# Altium project HVBoard.PrjPcb (part 1 of 2)
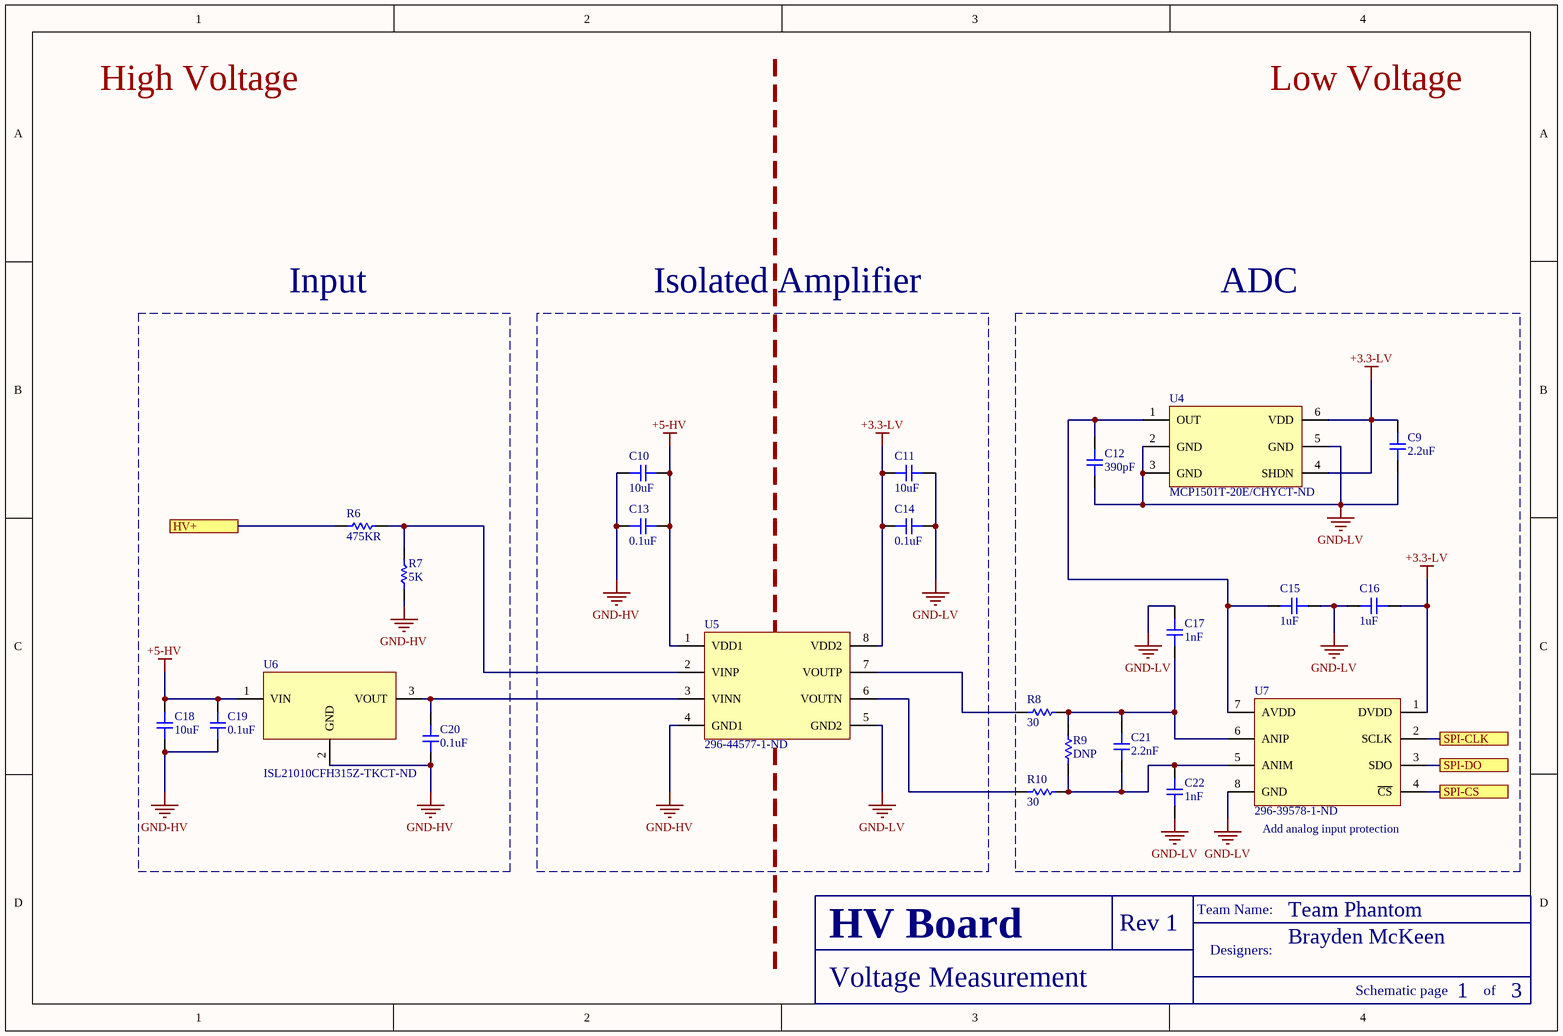
[diagram p0: VoltageMeasurement.SchDoc]
Board Name: HV Board; Designer1: Brayden McKeen; Rev: Rev 1; Team Name: Team Phantom
5 sheets, 89 parts. Net scope: global (net labels, ports and power ports of the same name join across sheets).
Board file: HVBoard_PCB.PcbDoc
Sheets:
  VoltageMeasurement.SchDoc
  IsoPowerSupply.SchDoc
  IMD.SchDoc
  ConnectorsAndProtection.SchDoc
  HVPowerSupply.SchDoc

## Sheet VoltageMeasurement.SchDoc
size A4; SheetNumber: 1; SheetTotal: 3; Schematic: Voltage Measurement

### Parts
C9  2.2uF  [CAP-0603]
C10  10uF  [CAP-1206]
C11  10uF  [CAP-1206]
C12  390pF  [CAP-0805]
C13  0.1uF  [CAP-0805]
C14  0.1uF  [CAP-0805]
C15  1uF  [CAP-0805]
C16  1uF  [CAP-0805]
C17  1nF  [CAP-0603]
C18  10uF  [CAP-1206]
C19  0.1uF  [CAP-0805]
C20  0.1uF  [CAP-0805]
C21  2.2nF  [CAP-0603]
C22  1nF  [CAP-0603]
R6  475KR  [RES-0805]
R7  5K  [RES-0603]
R8  30  [RES-0805]
R9  DNP  [RES-0805]
R10  30  [RES-0805]
U4  MCP1501T-20E/CHYCT-ND  [SOT-23-6]
U5  296-44577-1-ND  [8-SOICW]
U6  ISL21010CFH315Z-TKCT-ND  [SOT-23-3]
U7  296-39578-1-ND  [8VSSOP]

### Blocks framed on the sheet
Input: C18-C20 R6 R7 U6
Isolated Amplifier: C10 C11 C13 C14 U5
ADC: C9 C12 C15-C17 C21 C22 R8-R10 U4 U7

### Ports
HV+, SPI-CLK, SPI-CS, SPI-DO

### Nets
+3.3-LV: C9.2 C11.1 C14.1 C16.2 U4.4(SHDN) U4.6(VDD) U5.8(VDD2) U7.1(DVDD)
+5-HV: C10.2 C13.2 C18.2 C19.2 U5.1(VDD1) U6.1(VIN)
GND-HV: C10.1 C13.1 C18.1 C19.1 C20.1 R7.1 U5.4(GND1) U6.2(GND)
GND-LV: C9.1 C11.2 C12.1 C14.2 C15.2 C16.1 C17.2 C22.1 U4.2(GND) U4.3(GND) U4.5(GND) U5.5(GND2) U7.8(GND)
NetC1_2: R6.1 ; port HV+
NetC12_2: C12.2 C15.1 U4.1(OUT) U7.7(AVDD)
NetC17_1: C17.1 C21.2 R8.2 R9.2 U7.6(ANIP)
NetC20_2: C20.2 U5.3(VINN) U6.3(VOUT)
NetC21_1: C21.1 C22.2 R9.1 R10.2 U7.5(ANIM)
NetD6_11: U7.4(~{CS}) ; port SPI-CS
NetD6_12: U7.3(SDO) ; port SPI-DO
NetD6_13: U7.2(SCLK) ; port SPI-CLK
NetR6_2: R6.2 R7.2 U5.2(VINP)
NetR8_1: R8.1 U5.7(VOUTP)
NetR10_1: R10.1 U5.6(VOUTN)

### Notes on the sheet
- (near U7) Add analog input protection
- High Voltage
- Low Voltage
- Team Name:
- Designers:
- Schematic page
- of

### Library data of the parts
C9 = 0603-2.2uF-25V: CAP CER 2.2UF 25V X5R 0603; Manufacturer: Murata; Manufacturer Part Number: GRM188R61E225MA12D; Tolerance: 20%; Supplier 1: Digi-Key; Stock 1: 132633; Pricing 1: 1=0.16, 10=0.115, 100=0.0539, 500=0.03782, 1000=0.0313 (USD); Mount: Surface Mount; Case/Package: 0603; Weight: 0.000222oz; Case Code (Metric): 1608; Case Code (Imperial): 0603; Min Operating Temperature: -55°C; Max Operating Temperature: 85°C; Capacitance: 2.2uF; Packaging: Tape and Reel; Voltage Rating: 25V; Dielectric: X5R; Termination: SMD/SMT; Composition: Ceramic; Voltage Rating (DC): 25V; Package Quantity: 4000; Length: 0.063inch; Height: 0.8mm; Width: 0.031inch; Thickness: 0.035inch; ComponentLink1URL: http://search.murata.co.jp/Ceramy/image/img/A01X/G101/ENG/GRM188R61E225MA12-01.pdf?src-supplier=Digi-Key; ComponentLink1Description: http://search.murata.co.jp/Ceramy/image/img/A01X/G101/ENG/GRM188R61E225MA12-01.pdf?src-supplier=Digi-Key; ComponentLink2URL: http://www.mouser.com/ds/2/281/c02e-2905.pdf?src-supplier=Mouser; ComponentLink2Description: http://www.mouser.com/ds/2/281/c02e-2905.pdf?src-supplier=Mouser; Supplier Part Number 1: 490-12738-6-ND
C10 C11 C18 = 1206-10uF-50V: CAP CER 10UF 50V X5R 1206; Manufacturer: Murata; Manufacturer Part Number: GRT31CR61H106ME01L; Tolerance: 20%; Supplier 1: Digi-Key; Stock 1: 247205; Pricing 1: 1=0.5, 10=0.349, 100=0.2092, 500=0.1569, 1000=0.13249 (USD); Mount: Surface Mount; Case/Package: 1206; Case Code (Metric): 3216; Case Code (Imperial): 1206; Min Operating Temperature: -55°C; Max Operating Temperature: 85°C; Packaging: Tape and Reel; Capacitance: 10uF; Voltage Rating: 50V; Length: 0.126inch; Width: 0.063inch; Thickness: 0.071inch; Ratings: AEC-Q200; ComponentLink1URL: http://search.murata.co.jp/Ceramy/image/img/A01X/G101/ENG/GRT31CR61H106ME01-01.pdf?src-supplier=Digi-Key; ComponentLink1Description: http://search.murata.co.jp/Ceramy/image/img/A01X/G101/ENG/GRT31CR61H106ME01-01.pdf?src-supplier=Digi-Key; Supplier Part Number 1: 490-12457-1-ND
C12 = 0805-390pF-50V: CAP CER 390PF 50V C0G/NP0 0805; Manufacturer: KEMET; Manufacturer Part Number: C0805C391J5GACTU; Dielectric Material: Ceramic; Tolerance: 5%; Dissipation Factor: 0.1%; Dielectric: C0G; Supplier 1: Digi-Key; Stock 1: 12778; Pricing 1: 1=0.15, 10=0.105, 100=0.0495, 500=0.03472, 1000=0.02875 (USD); Mount: Surface Mount,PCB; Case/Package: 0805; Case Code (Metric): 2012; Case Code (Imperial): 0805; Contact Material: Tin; Contact Plating: Tin,Matte; Min Operating Temperature: -55°C; Max Operating Temperature: 125°C; Package Quantity: 1; Capacitance: 390pF; Voltage Rating: 50V; Packaging: Tape and Reel; Termination: SMD/SMT; Voltage Rating (DC): 50V; Voltage: 50V; Length: 2mm; Height: 0.78mm; Width: 0.049inch; Lead Pitch: 0.75mm; Depth: 1.25mm; Thickness: 0.035inch; Radiation Hardening: No; REACH SVHC: No SVHC; Lead Free: Lead Free; ComponentLink1URL: https://search.kemet.com/component-edge/download/datasheet/C0805C391J5GACTU.pdf?src-supplier=Digi-Key; ComponentLink1Description: https://search.kemet.com/component-edge/download/datasheet/C0805C391J5GACTU.pdf?src-supplier=Digi-Key; ComponentLink2URL: https://www.verical.com/server-webapp/html/getDatasheet?partID=35246&src-supplier=Verical; ComponentLink2Description: https://www.verical.com/server-webapp/html/getDatasheet?partID=35246&src-supplier=Verical; ComponentLink3URL: https://www.alliedelec.com/m/d/9bfe7773041ffe9d406e68bc7b377fdd.pdf?src-supplier=Allied+Electronics; ComponentLink3Description: https://www.alliedelec.com/m/d/9bfe7773041ffe9d406e68bc7b377fdd.pdf?src-supplier=Allied+Electronics; ComponentLink4URL: http://www.farnell.com/datasheets/1372242.pdf?src-supplier=Element14; ComponentLink4Description: http://www.farnell.com/datasheets/1372242.pdf?src-supplier=Element14; ComponentLink5URL: http://www.jameco.com/Jameco/Products/ProdDS/1567367.pdf?src-supplier=Jameco; ComponentLink5Description: http://www.jameco.com/Jameco/Products/ProdDS/1567367.pdf?src-supplier=Jameco; Supplier Part Number 1: 399-1132-6-ND
C13 C14 C19 C20 = 0805-0.1uF-16V: CAP CER 0.1UF 16V Y5V 0805; Manufacturer: KEMET; Manufacturer Part Number: C0805C104Z4VACTU; Dielectric Material: Ceramic; Capacitance: 100nF; Tolerance: 80%; Supplier 1: Digi-Key; Stock 1: 18565; Pricing 1: 1=0.11, 10=0.081, 100=0.038, 500=0.02664, 1000=0.02205 (USD); Mount: Surface Mount; Case/Package: 0805; Case Code (Metric): 2012; Case Code (Imperial): 0805; Min Operating Temperature: -30°C; Max Operating Temperature: 85°C; Package Quantity: 1; Voltage Rating: 16V; Packaging: Tape and Reel; Voltage Rating (DC): 16V; Dielectric: Y5V; Termination: SMD/SMT; Length: 2mm; Height: 0.78mm; Width: 0.049inch; Thickness: 0.035inch; Lead Pitch: 0.75mm; Depth: 1.25mm; Lead Free: Lead Free; ComponentLink1URL: https://search.kemet.com/component-edge/download/datasheet/C0805C104Z4VACTU.pdf?src-supplier=Digi-Key; ComponentLink1Description: https://search.kemet.com/component-edge/download/datasheet/C0805C104Z4VACTU.pdf?src-supplier=Digi-Key; ComponentLink2URL: https://api.kemet.com/component-edge/download/datasheet/C0805C104Z4VACTU.pdf?src-supplier=Digi-Key; ComponentLink2Description: https://api.kemet.com/component-edge/download/datasheet/C0805C104Z4VACTU.pdf?src-supplier=Digi-Key; ComponentLink3URL: http://www.mouser.com/ds/2/212/KEM_C1005_Y5V_SMD-1101305.pdf?src-supplier=Mouser; ComponentLink3Description: http://www.mouser.com/ds/2/212/KEM_C1005_Y5V_SMD-1101305.pdf?src-supplier=Mouser; ComponentLink4URL: http://components.arrow.com/part/dataview/2091119S8993596N7429?src-supplier=Arrow; ComponentLink4Description: http://components.arrow.com/part/dataview/2091119S8993596N7429?src-supplier=Arrow; Supplier Part Number 1: 399-9159-6-ND
C15 C16 = 0805-1uF-16V: CAP CER 1UF 16V Y5V 0805; Manufacturer: KEMET; Manufacturer Part Number: C0805C105Z4VACTU; Dielectric Material: Ceramic; Tolerance: 80%; Dissipation Factor: 7%; Supplier 1: Digi-Key; Stock 1: 54729; Pricing 1: 1=0.12, 10=0.085, 100=0.0378, 500=0.02702, 1000=0.02124 (USD); Mount: Surface Mount,PCB; Case/Package: 0805; Number of Pins: 2; Case Code (Metric): 2012; Case Code (Imperial): 0805; Contact Material: Tin; Min Operating Temperature: -30°C; Max Operating Temperature: 85°C; Package Quantity: 1; Capacitance: 1uF; Voltage Rating: 16V; Packaging: Tape and Reel; Voltage Rating (DC): 16V; Dielectric: Y5V; Termination: SMD/SMT; Voltage: 16V; Length: 2mm; Height: 1.25mm; Width: 0.049inch; Thickness: 0.055inch; Lead Pitch: 0.75mm; Depth: 1.25mm; Radiation Hardening: No; REACH SVHC: No SVHC; Lead Free: Lead Free; ComponentLink1URL: http://www.farnell.com/datasheets/2739656.pdf?src-supplier=Farnell; ComponentLink1Description: http://www.farnell.com/datasheets/2739656.pdf?src-supplier=Farnell; ComponentLink2URL: http://capacitoredge.kemet.com/capedge2/DataSheet?pn=C0805C105Z4VAC7800&src-supplier=Avnet+Europe; ComponentLink2Description: http://capacitoredge.kemet.com/capedge2/DataSheet?pn=C0805C105Z4VAC7800&src-supplier=Avnet+Europe; ComponentLink3URL: https://www.alliedelec.com/m/d/9bfe7773041ffe9d406e68bc7b377fdd.pdf?src-supplier=Allied+Electronics; ComponentLink3Description: https://www.alliedelec.com/m/d/9bfe7773041ffe9d406e68bc7b377fdd.pdf?src-supplier=Allied+Electronics; ComponentLink4URL: http://www.farnell.com/datasheets/2739656.pdf?src-supplier=Newark; ComponentLink4Description: http://www.farnell.com/datasheets/2739656.pdf?src-supplier=Newark; Supplier Part Number 1: 399-8011-6-ND
C17 C22 = 0603-1nF-50V: CAP CER 1000PF 50V X7R 0603; Manufacturer: KEMET; Manufacturer Part Number: C0603C102J5RACTU; Dielectric Material: Ceramic; Tolerance: 5%; Dissipation Factor: 2.5%; Supplier 1: Digi-Key; Stock 1: 378254; Pricing 1: 1=0.1, 10=0.056, 100=0.0248, 500=0.01772, 1000=0.01392 (USD); Mount: Surface Mount; Case/Package: 0603; Number of Pins: 2; Case Code (Imperial): 0603; Case Code (Metric): 1608; Min Operating Temperature: -55°C; Max Operating Temperature: 125°C; Packaging: Tape and Reel; Capacitance: 1nF; Dielectric: X7R; Voltage Rating (DC): 50V; Package Quantity: 1; Voltage Rating: 50V; Termination: SMD/SMT; Length: 1.6mm; Height: 0.8mm; Width: 0.031inch; Depth: 0.8mm; Thickness: 0.034inch; Lead Pitch: 0.7mm; Radiation Hardening: No; REACH SVHC: No SVHC; ComponentLink1URL: http://www.onlinecomponents.com/productFiles/mf-KEM/docfinderpartnumberc0402c102k5ractu.pdf?src-supplier=Onlinecomponents.com; ComponentLink1Description: http://www.onlinecomponents.com/productFiles/mf-KEM/docfinderpartnumberc0402c102k5ractu.pdf?src-supplier=Onlinecomponents.com; Supplier Part Number 1: 399-1083-6-ND
C21 = 0603-2.2nF-50V: CAP CER SMD 0603 2200PF 10% X7R; Manufacturer: KEMET; Manufacturer Part Number: C0603C222K5RAC7411; Dielectric Material: Ceramic; Voltage Rating: 50V; Dissipation Factor: 2.5%; Supplier 1: Digi-Key; Stock 1: 56383; Pricing 1: 1=0.1, 10=0.042, 100=0.0186, 500=0.01328, 1000=0.01044, 2500=0.00949, 5000=0.00873 (USD); Mount: Surface Mount; Case/Package: 0603; Case Code (Imperial): 0603; Case Code (Metric): 1608; Min Operating Temperature: -55°C; Max Operating Temperature: 125°C; Capacitance: 2.2nF; Tolerance: 10%; Package Quantity: 10000; Packaging: Tape and Reel; Voltage Rating (DC): 50V; Dielectric: X7R; Termination: SMD/SMT; Length: 1.6mm; Height: 0.8mm; Width: 0.8mm; Lead Pitch: 0.7mm; Depth: 0.8mm; Radiation Hardening: No; ComponentLink1URL: http://www.mouser.com/ds/2/212/KEM_C1002_X7R_SMD-1102033.pdf?src-supplier=Mouser; ComponentLink1Description: http://www.mouser.com/ds/2/212/KEM_C1002_X7R_SMD-1102033.pdf?src-supplier=Mouser; Supplier Part Number 1: 399-17586-6-ND
R6 = 0805-475KR: RES 475K OHM 0.1% 1/8W 0805; Supplier 1: Digi-Key; Supplier Part Number 1: P475KDACT-ND
R7 = 0603-5KR: RES SMD 4.99K OHM 1% 1/10W 0603; Manufacturer: Bourns; Manufacturer Part Number: CR0603-FX-4991ELF; Resistance: 4.99kR; Power Rating: 100mW; Voltage Rating: 50V; Temperature Coefficient: 100ppm/°C; Supplier 1: Digi-Key; Stock 1: 70557; Pricing 1: 1=0.1, 10=0.02, 25=0.0144, 50=0.011, 100=0.0082, 250=0.00624, 500=0.00498, 1000=0.00367 (USD); Mount: Surface Mount; Case/Package: 0603; Case Code (Imperial): 0603; Case Code (Metric): 1608; Contact Plating: Tin; Min Operating Temperature: -55°C; Max Operating Temperature: 155°C; Tolerance: 1%; Packaging: Tape and Reel; Package Quantity: 1; Composition: Thick Film; Termination: SMD/SMT; Number of Terminations: 2; Max Power Dissipation: 100mW; Features: Moisture Resistant; Length: 0.063inch; Height: 0.022inch; Width: 0.8mm; Thickness: 457um; Radiation Hardening: No; ComponentLink1URL: https://www.bourns.com/docs/Product-Datasheets/CHPREZTR.pdf?src-supplier=Digi-Key; ComponentLink1Description: https://www.bourns.com/docs/Product-Datasheets/CHPREZTR.pdf?src-supplier=Digi-Key; ComponentLink2URL: http://www.bourns.com/pdfs/chpreztr.pdf?src-supplier=Avnet; ComponentLink2Description: http://www.bourns.com/pdfs/chpreztr.pdf?src-supplier=Avnet; Supplier Part Number 1: CR0603-FX-4991ELFDKR-ND
R8 R10 = 0805-30R: RES SMD 30 OHM 1% 1/8W 0805; Supplier 1: Digi-Key; Supplier Part Number 1: P30.0CCT-ND
U4 = VREF 2.048V 0.1%: IC VREF SERIES 0.1% SOT23-6; Supplier 1: Digi-Key; Supplier Part Number 1: MCP1501T-20E/CHYCT-ND
U5 = OPAMP-ISO-AMC1301DWVR: IC OPAMP ISOLATION 1 CIRC 8SOIC; Manufacturer: Texas Instruments; Number of Circuits: 1; Gain Bandwidth Product: 1MHz; Input Bias Current: 60uA; Input Offset Voltage (Vos): 50uV; Operating Supply Current: 5.9mA; Output Current per Channel: 13mA; Isolation Voltage: 1kV; Bandwidth: 210kHz; Supplier 1: Digi-Key; Manufacturer Part Number: AMC1301DWVR; Stock 1: 2458; Pricing 1: 1=6.07, 10=5.487, 25=5.2316, 100=4.3384, 250=3.9556, 500=3.7004 (USD); Mount: Surface Mount; Case/Package: SOIC; Number of Pins: 8; Min Operating Temperature: -40°C; Max Operating Temperature: 125°C; Packaging: Cut Tape; Number of Amplifiers: 1; REACH SVHC: No SVHC; Lead Free: Lead Free; ComponentLink1URL: http://www.ti.com/lit/wp/sszy024/sszy024.pdf?src-supplier=Digi-Key; ComponentLink1Description: http://www.ti.com/lit/wp/sszy024/sszy024.pdf?src-supplier=Digi-Key; ComponentLink2URL: http://www.ti.com/lit/ds/symlink/amc1301.pdf?src-supplier=Farnell; ComponentLink2Description: http://www.ti.com/lit/ds/symlink/amc1301.pdf?src-supplier=Farnell; ComponentLink3URL: http://www.farnell.com/datasheets/2113482.pdf?src-supplier=Element14; ComponentLink3Description: http://www.farnell.com/datasheets/2113482.pdf?src-supplier=Element14; Supplier Part Number 1: 296-44577-6-ND
U6 = VREF 1.5V 0.2%: IC VREF SERIES 0.2% SOT23-3; Supplier 1: Digi-Key; Supplier Part Number 1: ISL21010CFH315Z-TKCT-ND
U7 = ADC-ADS7044IDCUR: IC ADC 12BIT SAR 8VSSOP; Manufacturer: Texas Instruments; Manufacturer Part Number: ADS7044IDCUT; Number of Bits: 12; Sampling Rate: 1MS/s; Number of Inputs: 1; Interface: SPI; Resolution: 12b; Polarity: Unipolar; Signal to Noise Ratio (SNR): 71dB; Supply Type: Analog,Digital; Max Power Dissipation: 900uW; Min Dual Supply Voltage: 1.8V; Max Supply Voltage: 3.6V; Integral Nonlinearity (INL): 2LSB; Supplier 1: Digi-Key; Stock 1: 68; Pricing 1: 1=2.66, 10=2.385, 25=2.2544, 100=1.8537 (USD); Mount: Surface Mount; Case/Package: SOP; Number of Pins: 8; Weight: 0.030018oz; Contact Plating: Gold; Min Operating Temperature: -40°C; Max Operating Temperature: 125°C; Packaging: Tape and Reel; Number of A/D Converters: 1; Number of Analog Inputs: 1; Number of Channels: 1; Package Quantity: 250; Max Dual Supply Voltage: 3.6V; Lead Free: Lead Free; ComponentLink1URL: http://www.ti.com/general/docs/lit/getliterature.tsp?genericPartNumber=ADS7044&&fileType=pdf&src-supplier=Avnet; ComponentLink1Description: http://www.ti.com/general/docs/lit/getliterature.tsp?genericPartNumber=ADS7044&&fileType=pdf&src-supplier=Avnet; ComponentLink2URL: http://www.ti.com/lit/ds/symlink/ads7044.pdf?src-supplier=Digi-Key; ComponentLink2Description: http://www.ti.com/lit/ds/symlink/ads7044.pdf?src-supplier=Digi-Key; ComponentLink3URL: http://www.ti.com/lit/gpn/ads7044?src-supplier=Mouser; ComponentLink3Description: http://www.ti.com/lit/gpn/ads7044?src-supplier=Mouser; Supplier Part Number 1: 296-39578-6-ND

## Sheet IsoPowerSupply.SchDoc
size A4; SheetNumber: 2; SheetTotal: 3; Schematic: Power Supply
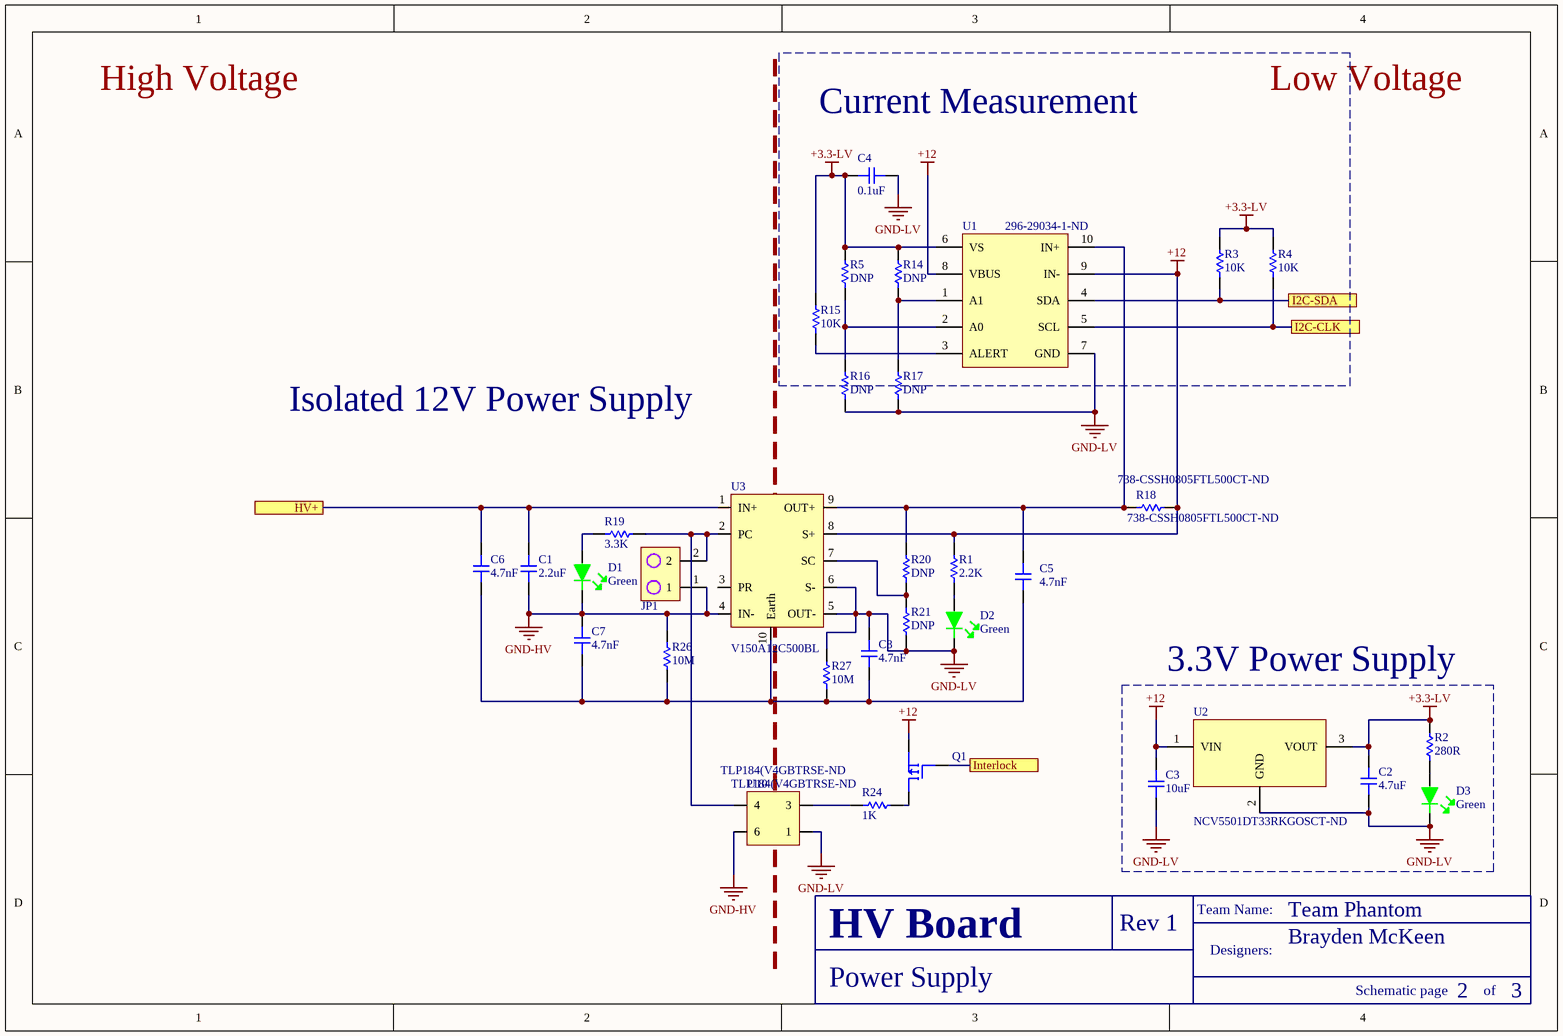
[diagram p1: IsoPowerSupply.SchDoc]

### Parts
C1  2.2uF  [CAP-2220]
C2  4.7uF  [CAP-0805]
C3  10uF  [CAP-1206]
C4  0.1uF  [CAP-0805]
C5  4.7nF  [CAP-0805]
C6  4.7nF  [CAP-0805]
C7  4.7nF  [CAP-0805]
C8  4.7nF  [CAP-0805]
D1  Green  [LED-0603]
D2  Green  [LED-0603]
D3  Green  [LED-0603]
JP1  732-5315-ND  [2PIN-JP]  (value not drawn)
Q1  448-ISS17EP06LMXTSA1CT-ND  [SOT-23-3]  (value not drawn)
R1  2.2K  [RES-0805]
R2  280R  [RES-0805]
R3  10K  [RES-0805]
R4  10K  [RES-0805]
R5  DNP  [RES-0805]
R14  DNP  [RES-0805]
R15  10K  [RES-0805]
R16  DNP  [RES-0805]
R17  DNP  [RES-0805]
R18  738-CSSH0805FTL500CT-ND  [RES-0805]
R19  3.3K  [RES-0805]
R20  DNP  [RES-0805]
R21  DNP  [RES-0805]
R24  1K  [RES-0805]
R26  10M  [RES-0805]
R27  10M  [RES-0805]
U1  296-29034-1-ND  [10MSOP]
U2  NCV5501DT33RKGOSCT-ND  [DPAK-TO252]
U3  V150A12C500BL  [DCDC-200V-12V-500W]
U10  TLP184(V4GBTRSE-ND  [Photocoupler]

### Blocks framed on the sheet
Current Measurement: C4 R3-R5 R14-R17 U1
3.3V Power Supply: C2 C3 D3 R2 U2

### Ports
HV+, I2C-CLK, I2C-SDA, Interlock

### Nets
+3.3-LV: C2.2 C4.1 R2.2 R3.2 R4.2 R5.2 R14.2 R15.2 U1.6(VS) U2.3(VOUT)
+12: C3.2 Q1.2 R1.2 R18.2 U1.8(VBUS) U1.9(IN-) U2.1(VIN) U3.8(S+)
GND-HV: C1.1 C7.2 D1.2 JP1.1 R26.1 U3.4(IN-) U10.6
GND-LV: C2.1 C3.1 C4.2 C8.2 D2.2 D3.2 R16.1 R17.1 R21.2 R27.2 U1.7(GND) U2.2(GND) U3.5(OUT-) U3.6(S-) U10.1
NetC1_2: C1.2 C6.2 U3.1(IN+) ; port HV+
NetC5_1: C5.1 C6.1 C7.1 C8.1 R26.2 R27.1 U3.10(Earth)
NetC5_2: C5.2 R18.1 R20.2 U1.10(IN+) U3.9(OUT+)
NetD1_1: D1.1 R19.1
NetD2_1: D2.1 R1.1
NetD3_1: D3.1 R2.1
NetD4_2: Q1.1 ; port Interlock
NetD6_9: R4.1 U1.5(SCL) ; port I2C-CLK
NetD6_10: R3.1 U1.4(SDA) ; port I2C-SDA
NetJP1_2: JP1.2 R19.2 U3.2(PC) U10.4
NetQ1_3: Q1.3 R24.2
NetR5_1: R5.1 R16.2 U1.2(A0)
NetR14_1: R14.1 R17.2 U1.1(A1)
NetR15_1: R15.1 U1.3(ALERT)
NetR20_1: R20.1 R21.1 U3.7(SC)
NetR24_1: R24.1 U10.3

Not connected (* = marked no-connect by the designer): U3 3(PR)

### Notes on the sheet
- Isolated 12V Power Supply
- High Voltage
- Low Voltage
- Team Name:
- Designers:
- Schematic page
- of

### Library data of the parts
C1 = 2220-2.2uF-450V: CAP CER 2.2UF 450V X6S 2220; Manufacturer: TDK; Manufacturer Part Number: C5750X6S2W225K250KA; Tolerance: 10%; Supplier 1: Digi-Key; Stock 1: 8149; Pricing 1: 1=3.66, 10=2.957, 100=2.258 (USD); Mount: Surface Mount; Case/Package: 2220; Weight: 0.016932oz; Case Code (Metric): 5750; Case Code (Imperial): 2220; Min Operating Temperature: -55°C; Max Operating Temperature: 105°C; Package Quantity: 1; Capacitance: 2.2uF; Voltage Rating: 450V; Packaging: Tape and Reel; Dielectric: X6S; Termination: SMD/SMT; Voltage Rating (DC): 450V; Length: 5.7mm; Height: 2.5mm; Width: 0.197inch; Thickness: 0.11inch; Depth: 5mm; Radiation Hardening: No; REACH SVHC: No SVHC; Lead Free: Lead Free; ComponentLink1URL: http://product.tdk.com/capacitor/mlcc/en/documents/mlcc_commercial_midvoltage_en.pdf?src-supplier=Avnet+Europe; ComponentLink1Description: http://product.tdk.com/capacitor/mlcc/en/documents/mlcc_commercial_midvoltage_en.pdf?src-supplier=Avnet+Europe; Supplier Part Number 1: 445-7781-6-ND
C2 = 0805-4.7uF-16V: CAP CER 4.7UF 16V X5R 0805; Manufacturer: KEMET; Manufacturer Part Number: C0805C475K4PACTU; Dielectric Material: Ceramic; Tolerance: 10%; Supplier 1: Digi-Key; Stock 1: 96594; Pricing 1: 1=0.24, 10=0.168, 100=0.0951, 500=0.0671, 1000=0.05872 (USD); Mount: Surface Mount; Case/Package: 0805; Min Operating Temperature: -55°C; Max Operating Temperature: 85°C; Capacitance: 4.7uF; Packaging: Tape and Reel; Dielectric: X5R; Voltage: 16V; Termination: SMD/SMT; Voltage Rating (DC): 16V; Length: 2mm; Height: 1.25mm; Depth: 1.25mm; Radiation Hardening: No; Lead Free: Lead Free; ComponentLink1URL: http://capacitoredge.kemet.com/capedge2/DataSheet?pn=C0805C475K4PAC7800&src-supplier=Avnet+Europe; ComponentLink1Description: http://capacitoredge.kemet.com/capedge2/DataSheet?pn=C0805C475K4PAC7800&src-supplier=Avnet+Europe; ComponentLink2URL: https://www.verical.com/server-webapp/html/getDatasheet?partID=319476&src-supplier=Verical; ComponentLink2Description: https://www.verical.com/server-webapp/html/getDatasheet?partID=319476&src-supplier=Verical; Supplier Part Number 1: 399-8101-6-ND
C3 = 1206-10uF-50V: as C10 on sheet VoltageMeasurement; Supplier 1: Digi-Key; Stock 1: 247205; Pricing 1: 1=0.5, 10=0.349, 100=0.2092, 500=0.1569, 1000=0.13249 (USD); Mount: Surface Mount; Case/Package: 1206; Case Code (Metric): 3216; Case Code (Imperial): 1206; Min Operating Temperature: -55°C; Max Operating Temperature: 85°C; Packaging: Tape and Reel; Capacitance: 10uF; Voltage Rating: 50V; Length: 0.126inch; Width: 0.063inch; Thickness: 0.071inch; Ratings: AEC-Q200; ComponentLink1URL: http://search.murata.co.jp/Ceramy/image/img/A01X/G101/ENG/GRT31CR61H106ME01-01.pdf?src-supplier=Digi-Key; ComponentLink1Description: http://search.murata.co.jp/Ceramy/image/img/A01X/G101/ENG/GRT31CR61H106ME01-01.pdf?src-supplier=Digi-Key; Supplier Part Number 1: 490-12457-1-ND
C4 = 0805-0.1uF-16V: as C13 on sheet VoltageMeasurement; Supplier 1: Digi-Key; Stock 1: 18565; Pricing 1: 1=0.11, 10=0.081, 100=0.038, 500=0.02664, 1000=0.02205 (USD); Mount: Surface Mount; Case/Package: 0805; Case Code (Metric): 2012; Case Code (Imperial): 0805; Min Operating Temperature: -30°C; Max Operating Temperature: 85°C; Package Quantity: 1; Voltage Rating: 16V; Packaging: Tape and Reel; Voltage Rating (DC): 16V; Dielectric: Y5V; Termination: SMD/SMT; Length: 2mm; Height: 0.78mm; Width: 0.049inch; Thickness: 0.035inch; Lead Pitch: 0.75mm; Depth: 1.25mm; Lead Free: Lead Free; ComponentLink1URL: https://search.kemet.com/component-edge/download/datasheet/C0805C104Z4VACTU.pdf?src-supplier=Digi-Key; ComponentLink1Description: https://search.kemet.com/component-edge/download/datasheet/C0805C104Z4VACTU.pdf?src-supplier=Digi-Key; ComponentLink2URL: https://api.kemet.com/component-edge/download/datasheet/C0805C104Z4VACTU.pdf?src-supplier=Digi-Key; ComponentLink2Description: https://api.kemet.com/component-edge/download/datasheet/C0805C104Z4VACTU.pdf?src-supplier=Digi-Key; ComponentLink3URL: http://www.mouser.com/ds/2/212/KEM_C1005_Y5V_SMD-1101305.pdf?src-supplier=Mouser; ComponentLink3Description: http://www.mouser.com/ds/2/212/KEM_C1005_Y5V_SMD-1101305.pdf?src-supplier=Mouser; ComponentLink4URL: http://components.arrow.com/part/dataview/2091119S8993596N7429?src-supplier=Arrow; ComponentLink4Description: http://components.arrow.com/part/dataview/2091119S8993596N7429?src-supplier=Arrow; Supplier Part Number 1: 399-9159-6-ND
C5-C8 = 0805-4.7nF-250V: CAP CER 4700PF 250V X7R 0805; Supplier 1: Digi-Key; Supplier Part Number 1: 490-5593-1-ND
D1-D3 = LED-Green: LED GREEN CLEAR 0603 SMD; Manufacturer: Wurth Electronics; Manufacturer Part Number: 150060VS75000; Luminous Intensity: 40mcd; Viewing Angle: 140°; Forward Voltage: 2V; Wavelength: 570nm; Lens Style: Clear,Rectangular; Forward Current: 30mA; Test Current: 20mA; Supplier 1: Digi-Key; Stock 1: 118118; Pricing 1: 1=0.14, 50=0.133, 100=0.114, 500=0.099 (USD); Mount: Surface Mount; Case/Package: 0603; Number of Pins: 2; Color: Green; Case Code (Metric): 1608; Case Code (Imperial): 0603; Min Operating Temperature: -40°C; Max Operating Temperature: 85°C; Package Quantity: 1; Packaging: Tape and Reel; Dominant Wavelength: 570nm; Length: 1.6mm; Height: 0.7mm; Width: 0.8mm; REACH SVHC: Unknown; ComponentLink1URL: https://katalog.we-online.de/led/datasheet/150060VS75000.pdf?src-supplier=Digi-Key; ComponentLink1Description: https://katalog.we-online.de/led/datasheet/150060VS75000.pdf?src-supplier=Digi-Key; Supplier Part Number 1: 732-4980-1-ND
JP1 = 2PIN-TEST: CONN HEADER VERT 2POS 2.54MM
Q1 = P-FET-60V-0.3A: MOSFET P-CH 60V 300MA SOT23-3; Manufacturer: ON Semiconductor; On-State Resistance: 1.7R; Supplier 1: Digi-Key; Manufacturer Part Number: ISS17EP06LMXTSA1; Stock 1: 141691; Pricing 1: 1=0.25, 10=0.205, 25=0.172, 100=0.084, 250=0.08272, 500=0.0701, 1000=0.04871, 2500=0.04527, 5000=0.03916 (USD); Case/Package: SOT-23-3; Number of Pins: 3; Min Operating Temperature: -55°C; Max Operating Temperature: 150°C; ComponentLink1URL: http://www.onsemi.com/pub/Collateral/BSS138LT1-D.PDF?src-supplier=Digi-Key; ComponentLink1Description: http://www.onsemi.com/pub/Collateral/BSS138LT1-D.PDF?src-supplier=Digi-Key; ComponentLink2URL: http://www.farnell.com/datasheets/2353875.pdf?src-supplier=Element14; ComponentLink2Description: http://www.farnell.com/datasheets/2353875.pdf?src-supplier=Element14; ComponentLink3URL: http://www.onsemi.com/pub_link/Collateral/BSS138LT1-D.PDF?src-supplier=Avnet; ComponentLink3Description: http://www.onsemi.com/pub_link/Collateral/BSS138LT1-D.PDF?src-supplier=Avnet; ComponentLink4URL: https://www.verical.com/server-webapp/html/getDatasheet?partID=141721&src-supplier=Verical; ComponentLink4Description: https://www.verical.com/server-webapp/html/getDatasheet?partID=141721&src-supplier=Verical; ComponentLink5URL: http://www.onsemi.com/pub_link/Collateral/BSS138LT1-D.PDF?src-supplier=Future+Electronics; ComponentLink5Description: http://www.onsemi.com/pub_link/Collateral/BSS138LT1-D.PDF?src-supplier=Future+Electronics; Supplier Part Number 1: 448-ISS17EP06LMXTSA1CT-ND
R1 = 0805-2.2KR: RES SMD 2.2K OHM 1% 1/8W 0805; Manufacturer: Yageo; Manufacturer Part Number: RC0805FR-072K2L; Power Rating: 125mW; Resistance: 2.2kR; Temperature Coefficient: 100ppm/°C; Voltage Rating: 150V; Supplier 1: Digi-Key; Stock 1: 4156138; Pricing 1: 1=0.1, 10=0.04, 100=0.0163, 1000=0.00731, 2500=0.00635 (USD); Case/Package: 0805; Number of Pins: 2; Case Code (Imperial): 0805; Case Code (Metric): 2012; Min Operating Temperature: -55°C; Max Operating Temperature: 155°C; Tolerance: 1%; Packaging: Tape and Reel; Voltage Rating (DC): 150V; Package Quantity: 1; Termination: SMD/SMT; Composition: Thick Film; Number of Terminations: 2; Max Power Dissipation: 125mW; Features: Moisture Resistant; Military Standard: Not; Length: 2mm; Height: 0.5mm; Width: 1.25mm; Depth: 1.25mm; Lead Pitch: 0.4mm; REACH SVHC: Unknown; Lead Free: Lead Free; ComponentLink1URL: http://www.farnell.com/datasheets/38627.pdf?src-supplier=Element14; ComponentLink1Description: http://www.farnell.com/datasheets/38627.pdf?src-supplier=Element14; ComponentLink2URL: http://www.farnell.com/datasheets/444164.pdf?src-supplier=Element14; ComponentLink2Description: http://www.farnell.com/datasheets/444164.pdf?src-supplier=Element14; ComponentLink3URL: http://www.yageo.com/documents/recent/PYu-RC_Group_51_RoHS_L_9.pdf?src-supplier=Digi-Key; ComponentLink3Description: http://www.yageo.com/documents/recent/PYu-RC_Group_51_RoHS_L_9.pdf?src-supplier=Digi-Key; ComponentLink4URL: http://www.yageo.com/documents/recent/PYu-RC_Group_51_RoHS_L_10.pdf?src-supplier=Digi-Key; ComponentLink4Description: http://www.yageo.com/documents/recent/PYu-RC_Group_51_RoHS_L_10.pdf?src-supplier=Digi-Key; Supplier Part Number 1: 311-2.20KCRDKR-ND
R2 = 0805-280R: RES SMD 280 OHM 1% 1/8W 0805; Manufacturer: Yageo; Manufacturer Part Number: RC0805FR-07280RL; Temperature Coefficient: 100ppm/°C; Max Power Dissipation: 125mW; Voltage Rating (DC): 150V; Supplier 1: Digi-Key; Stock 1: 43663; Pricing 1: 1=0.1, 10=0.04, 100=0.0163, 1000=0.00731, 2500=0.00635 (USD); Case/Package: 0805; Case Code (Imperial): 0805; Case Code (Metric): 2012; Min Operating Temperature: -55°C; Max Operating Temperature: 155°C; Package Quantity: 1; Resistance: 280R; Tolerance: 1%; Packaging: Tape and Reel; Composition: Thick Film; Number of Terminations: 2; Features: Moisture Resistant; Power Rating: 125mW; Voltage Rating: 150V; Termination: SMD/SMT; Military Standard: Not; Length: 2mm; Height: 0.024inch; Width: 1.25mm; Depth: 1.25mm; Lead Free: Lead Free; ComponentLink1URL: http://www.yageo.ru/pdf/RC0805.pdf?src-supplier=Mouser; ComponentLink1Description: http://www.yageo.ru/pdf/RC0805.pdf?src-supplier=Mouser; ComponentLink2URL: http://www.yageo.ru/pdf/RC0805.pdf?src-supplier=Future+Electronics; ComponentLink2Description: http://www.yageo.ru/pdf/RC0805.pdf?src-supplier=Future+Electronics; ComponentLink3URL: http://www.yageo.com.tw/exep/pages/download/literatures/PYu-R_INT-thick_7.pdf?src-supplier=Digi-Key; ComponentLink3Description: http://www.yageo.com.tw/exep/pages/download/literatures/PYu-R_INT-thick_7.pdf?src-supplier=Digi-Key; ComponentLink4URL: http://www.yageo.com/documents/recent/PYu-RC_Group_51_RoHS_L_9.pdf?src-supplier=Digi-Key; ComponentLink4Description: http://www.yageo.com/documents/recent/PYu-RC_Group_51_RoHS_L_9.pdf?src-supplier=Digi-Key; Supplier Part Number 1: 311-280CRDKR-ND
R3 R4 R15 = 0805-10KR: RES SMD 10K OHM 1% 1/8W 0805; Manufacturer: Yageo; Manufacturer Part Number: RC0805FR-0710KL; Resistance: 10kR; Temperature Coefficient: 100ppm/°C; Power Rating: 125mW; Voltage Rating: 150V; Supplier 1: Digi-Key; Stock 1: 26112993; Pricing 1: 1=0.1, 10=0.04, 100=0.0163, 1000=0.00731, 2500=0.00635 (USD); Case/Package: 0805; Case Code (Imperial): 0805; Case Code (Metric): 2012; Min Operating Temperature: -55°C; Max Operating Temperature: 155°C; Packaging: Tape and Reel; Tolerance: 1%; Composition: Thick Film; Package Quantity: 1; Termination: SMD/SMT; Number of Terminations: 2; Military Standard: Not; Max Power Dissipation: 125mW; Features: Moisture Resistant; Length: 2mm; Height: 0.024inch; Width: 0.049inch; Depth: 1.25mm; REACH SVHC: Unknown; Lead Free: Lead Free; ComponentLink1URL: http://www.yageo.com/documents/recent/PYu-RC_Group_51_RoHS_L_9.pdf?src-supplier=Mouser; ComponentLink1Description: http://www.yageo.com/documents/recent/PYu-RC_Group_51_RoHS_L_9.pdf?src-supplier=Mouser; ComponentLink2URL: http://www.farnell.com/datasheets/2167052.pdf?src-supplier=Element14; ComponentLink2Description: http://www.farnell.com/datasheets/2167052.pdf?src-supplier=Element14; ComponentLink3URL: http://www.yageo.com/documents/recent/PYu-RC_Group_51_RoHS_L_10.pdf?src-supplier=Digi-Key; ComponentLink3Description: http://www.yageo.com/documents/recent/PYu-RC_Group_51_RoHS_L_10.pdf?src-supplier=Digi-Key; ComponentLink4URL: http://www.yageo.ru/pdf/RC0805.pdf?src-supplier=Future+Electronics; ComponentLink4Description: http://www.yageo.ru/pdf/RC0805.pdf?src-supplier=Future+Electronics; Supplier Part Number 1: 311-10.0KCRCT-ND
R18 = 0805-0.0005R: RES SHUNT, 0805, 0.0005 OHM, 1%,; Supplier 1: Digi-Key; Supplier Part Number 1: 738-CSSH0805FTL500CT-ND
R19 = 0805-3.3KR: RES SMD 3.3K OHM 1% 1/8W 0805; Manufacturer: TE Connectivity; Manufacturer Part Number: CRGCQ0805F3K3; Supplier 1: Digi-Key; Stock 1: 41625; Pricing 1: 1=0.1, 10=0.048, 100=0.0196, 1000=0.00882, 2500=0.00766 (USD); ComponentLink1URL: https://4donline.ihs.com/images/VipMasterIC/IC/TYEL/TYEL-S-A0004929575/TYEL-S-A0004929575-1.pdf?hkey=52A5661711E402568146F3353EA87419&src-supplier=Farnell; ComponentLink1Description: https://4donline.ihs.com/images/VipMasterIC/IC/TYEL/TYEL-S-A0004929575/TYEL-S-A0004929575-1.pdf?hkey=52A5661711E402568146F3353EA87419&src-supplier=Farnell; Supplier Part Number 1: A129755DKR-ND
R24 = 0805-1KR: RES SMD 1K OHM 1% 1/8W 0805; Manufacturer: Yageo; Manufacturer Part Number: RC0805FR-071KL; Resistance: 1kR; Temperature Coefficient: 100ppm/°C; Voltage Rating (DC): 150V; Power Rating: 125mW; Supplier 1: Digi-Key; Stock 1: 21491700; Pricing 1: 1=0.1, 10=0.04, 100=0.0163, 1000=0.00731, 2500=0.00635 (USD); Case/Package: 0805; Number of Pins: 2; Case Code (Metric): 2012; Case Code (Imperial): 0805; Min Operating Temperature: -55°C; Max Operating Temperature: 155°C; Tolerance: 1%; Packaging: Tape and Reel; Composition: Thick Film; Package Quantity: 1; Voltage Rating: 150V; Number of Terminations: 2; Termination: SMD/SMT; Military Standard: Not; Max Power Dissipation: 125mW; Features: Moisture Resistant; Length: 0.079inch; Height: 0.024inch; Width: 0.049inch; Depth: 1.25mm; REACH SVHC: Unknown; Lead Free: Lead Free; ComponentLink1URL: http://www.yageo.com/documents/recent/PYu-RC_Group_51_RoHS_L_10.pdf?src-supplier=Digi-Key; ComponentLink1Description: http://www.yageo.com/documents/recent/PYu-RC_Group_51_RoHS_L_10.pdf?src-supplier=Digi-Key; ComponentLink2URL: http://www.farnell.com/datasheets/1686128.pdf?src-supplier=Element14; ComponentLink2Description: http://www.farnell.com/datasheets/1686128.pdf?src-supplier=Element14; ComponentLink3URL: http://www.yageo.ru/pdf/RC0805.pdf?src-supplier=Future+Electronics; ComponentLink3Description: http://www.yageo.ru/pdf/RC0805.pdf?src-supplier=Future+Electronics; ComponentLink4URL: http://www.farnell.com/datasheets/2167052.pdf?src-supplier=Element14; ComponentLink4Description: http://www.farnell.com/datasheets/2167052.pdf?src-supplier=Element14; Supplier Part Number 1: 311-1.00KCRDKR-ND
R26 R27 = 0805-10MR: RES SMD 10M OHM 1% 1/8W 0805; Supplier Part Number 1: 311-10.0MCRCT-ND; Supplier 1: Digi-Key
U1 = PWR Monitor: IC MONITOR PWR/CURR BIDIR 10MSOP; Manufacturer: Texas Instruments; Manufacturer Part Number: INA226AIDGSR; Min Supply Voltage: 2.7V; Max Supply Voltage: 5.5V; Nominal Supply Current: 330uA; Common Mode Rejection Ratio: 140dB; Output Current: 10mA; Input Bias Current: 10uA; Input Offset Voltage (Vos): 2.5uV; Accuracy: 0.02%; Supplier 1: Digi-Key; Stock 1: 12662; Pricing 1: 1=3.18, 10=2.856, 25=2.7, 100=2.22, 250=1.992, 500=1.92, 1000=1.596 (USD); Mount: Surface Mount; Case/Package: VSSOP; Number of Pins: 10; Contact Plating: Gold; Min Operating Temperature: -40°C; Max Operating Temperature: 125°C; Packaging: Tape and Reel; Package Quantity: 1; Radiation Hardening: No; REACH SVHC: No SVHC; Lead Free: Lead Free; ComponentLink1URL: http://www.ti.com/lit/ds/symlink/ina226.pdf?src-supplier=Digi-Key; ComponentLink1Description: http://www.ti.com/lit/ds/symlink/ina226.pdf?src-supplier=Digi-Key; ComponentLink2URL: http://www.ti.com/general/docs/lit/getliterature.tsp?genericPartNumber=INA226&&fileType=pdf&src-supplier=Avnet; ComponentLink2Description: http://www.ti.com/general/docs/lit/getliterature.tsp?genericPartNumber=INA226&&fileType=pdf&src-supplier=Avnet; ComponentLink3URL: http://www.ti.com/lit/gpn/ina226?src-supplier=Mouser; ComponentLink3Description: http://www.ti.com/lit/gpn/ina226?src-supplier=Mouser; ComponentLink4URL: http://www.farnell.com/datasheets/1840205.pdf?src-supplier=Element14; ComponentLink4Description: http://www.farnell.com/datasheets/1840205.pdf?src-supplier=Element14; Supplier Part Number 1: 296-29034-1-ND
U2 = LDO-3.3V-500mA: IC REG LINEAR 3.3V 500MA DPAK; Manufacturer: ON Semiconductor; Min Input Voltage: 2.5V; Number of Outputs: 1; Max Input Voltage: 16V; Dropout Voltage: 230mV; Polarity: Positive; Accuracy: 2.9%; Output Type: Fixed; Supplier 1: Digi-Key; Manufacturer Part Number: NCV5501DT33RKG; Stock 1: 921; Pricing 1: 1=0.8, 10=0.7, 25=0.6576, 100=0.4984, 250=0.4242, 500=0.403, 1000=0.30755 (USD); Mount: Surface Mount; Case/Package: DPAK; Number of Pins: 3; Contact Plating: Tin,Matte; Min Operating Temperature: -40°C; Max Operating Temperature: 125°C; Output Voltage: 3.3V; Output Current: 500mA; Packaging: Tape and Reel; Max Output Current: 500mA; Package Quantity: 1; Number of Regulators: 1; Min Current Limit: 500mA; Min Output Voltage: 3.3V; Nominal Output Voltage: 3.3V; Output Voltage Accuracy: 2.9%; Length: 6.73mm; Height: 2.38mm; Width: 6.22mm; Radiation Hardening: No; REACH SVHC: No SVHC; Lead Free: Lead Free; ComponentLink1URL: http://www.onsemi.com/pub_link/Collateral/NCP5500-D.PDF?src-supplier=Future+Electronics; ComponentLink1Description: http://www.onsemi.com/pub_link/Collateral/NCP5500-D.PDF?src-supplier=Future+Electronics; ComponentLink2URL: http://www.onsemi.cn/pub_link/Collateral/NCP5500-D.PDF?src-supplier=Avnet; ComponentLink2Description: http://www.onsemi.cn/pub_link/Collateral/NCP5500-D.PDF?src-supplier=Avnet; ComponentLink3URL: http://www.onsemi.com/pub/Collateral/NCP5500-D.PDF?src-supplier=Avnet; ComponentLink3Description: http://www.onsemi.com/pub/Collateral/NCP5500-D.PDF?src-supplier=Avnet; ComponentLink4URL: http://www.onsemi.com/pub/Collateral/NCP5500-D.PDF?src-supplier=Digi-Key; ComponentLink4Description: http://www.onsemi.com/pub/Collateral/NCP5500-D.PDF?src-supplier=Digi-Key; Supplier Part Number 1: NCV5501DT33RKGOSDKR-ND
U3 = DCDC200V-12V: DC DC CONVERTER 12V 500W; Manufacturer: Vicor; Number of Outputs: 1; Efficiency: 87.6%; Min Input Voltage: 100V; Max Input Voltage: 200V; Max Output Current: 41.67A; Isolation Voltage: 3kV; Isolation: Isolated; Supplier 1: Digi-Key; Manufacturer Part Number: V150A12C500BL; Stock 1: 3; Pricing 1: 1=313.93, 10=303.804 (USD); Mount: Through Hole; Case/Package: Full Brick; Min Operating Temperature: -20°C; Max Operating Temperature: 100°C; Package Quantity: 1; Packaging: Bulk; Voltage - Output 1: 12V; Max Power Dissipation: 500W; Features: UVLO,OVP; Output Power: 500W; Output Voltage: 12V; Length: 4.6inch; Height: 0.62inch; Width: 2.2inch; Lead Free: Contains Lead; ComponentLink1URL: http://cdn.vicorpower.com/documents/datasheets/ds_150vin-maxi-family.pdf?src-supplier=Future+Electronics; ComponentLink1Description: http://cdn.vicorpower.com/documents/datasheets/ds_150vin-maxi-family.pdf?src-supplier=Future+Electronics; ComponentLink2URL: http://cdn.vicorpower.com/documents/datasheets/ds_150vin-maxi-family.pdf?src-supplier=Digi-Key; ComponentLink2Description: http://cdn.vicorpower.com/documents/datasheets/ds_150vin-maxi-family.pdf?src-supplier=Digi-Key; Supplier Part Number 1: 1102-1229-ND
U10 = Photocoupler: X36 PB-F PHOTOCOUPLER SO6 ROHS T; Supplier 1: Digi-Key; Supplier Part Number 1: TLP184(V4GBTRSE-ND

## Sheet IMD.SchDoc
size A4; SheetNumber: 3; SheetTotal: 3; Schematic: Isolation Monitoring Device
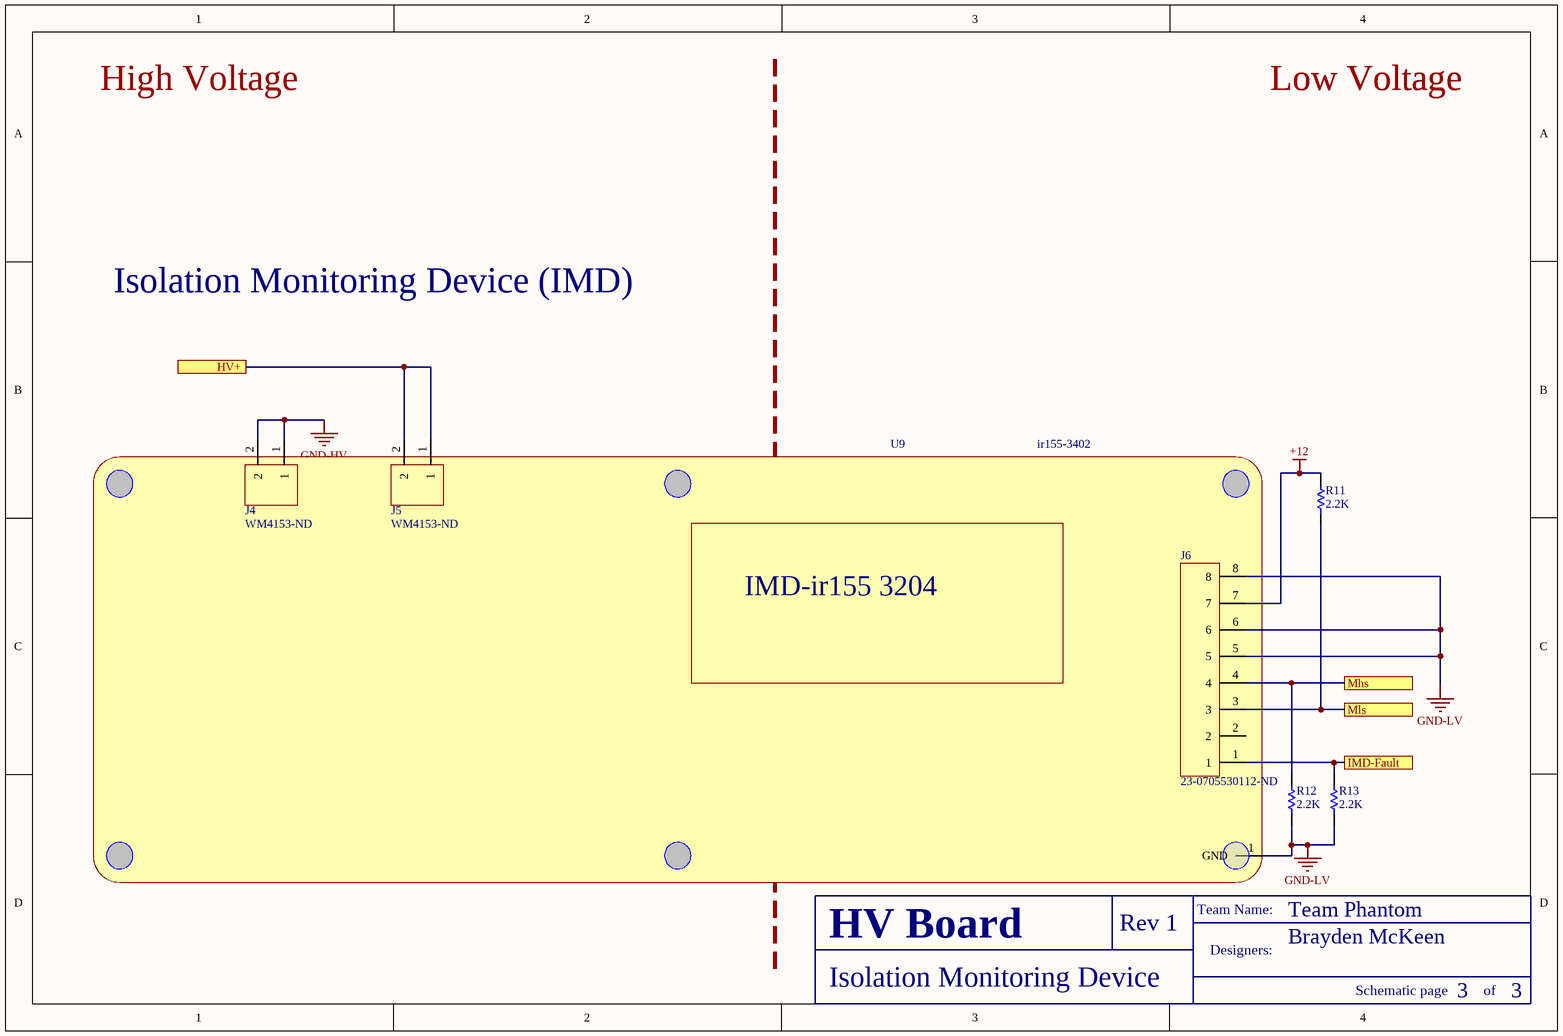
[diagram p2: IMD.SchDoc]

### Parts
J4  WM4153-ND  [2PIN]
J5  WM4153-ND  [2PIN]
J6  23-0705530112-ND  [8PIN]
R11  2.2K  [RES-0805]
R12  2.2K  [RES-0805]
R13  2.2K  [RES-0805]
U9  ir155-3402  [IMD-Bender ir155 3204]

### Ports
HV+, IMD-Fault, Mhs, Mls

### Nets
+12: J6.7 R11.2
GND-HV: J4.1 J4.2
GND-LV: J6.5 J6.6 J6.8 R12.1 R13.1 U9.1(GND)
NetC1_2: J5.1 J5.2 ; port HV+
NetD5_10: J6.1 R13.2 ; port IMD-Fault
NetD5_11: J6.3 R11.1 ; port Mls
NetD5_12: J6.4 R12.2 ; port Mhs

Not connected (* = marked no-connect by the designer): J6 2

### Notes on the sheet
- Low Voltage
- Isolation Monitoring Device (IMD)
- High Voltage
- Team Name:
- Designers:
- Schematic page
- of
- (in symbol IMD-ir155-3402) IMD-ir155 3204

### Library data of the parts
J4 J5 = 2PIN: CONN HEADER R/A 2POS 2.54MM; Manufacturer: Molex; Manufacturer Part Number: 0705530106; Number of Positions: 2; Contact Resistance: 30mR; Connector Type: Male Pin; Supplier 1: Digi-Key; Stock 1: 2224; Pricing 1: 1=1.38, 10=1.25, 100=1.071, 500=0.8925, 1000=0.765, 5000=0.6783, 10000=0.663 (USD); Mount: Through Hole; Housing Material: Polyester; Contact Plating: Gold; Contact Material: Bronze; Color: Black; Housing Color: Black; Min Operating Temperature: -40°C; Max Operating Temperature: 105°C; Number of Rows: 1; Packaging: Rail/Tube; Termination: Solder; Number of Contacts: 2; Orientation: Right Angle; Length: 7.37mm; Pitch: 2.54mm; Depth: 13.59mm; Contact Mating Length: 0.24inch; ComponentLink1URL: http://www.molex.com/webdocs/datasheets/pdf/en-us/0705530106_PCB_HEADERS.pdf?src-supplier=Avnet+Asia; ComponentLink1Description: http://www.molex.com/webdocs/datasheets/pdf/en-us/0705530106_PCB_HEADERS.pdf?src-supplier=Avnet+Asia; ComponentLink2URL: https://www.molex.com/pdm_docs/ps/PS-70400.pdf?src-supplier=Digi-Key; ComponentLink2Description: https://www.molex.com/pdm_docs/ps/PS-70400.pdf?src-supplier=Digi-Key; Supplier Part Number 1: WM4153-ND
J6 = 8PIN: CONN HEADER R/A 8POS 2.54MM; Manufacturer: Molex; Manufacturer Part Number: 70553-0112; Contact Resistance: 30mR; Current Rating: 3A; Voltage Rating: 250V; Number of Positions: 8; Insulation Resistance: 1GR; Connector Type: Male Pin; Glow Wire Compliant: Non-compliant; Supplier 1: Digi-Key; Stock 1: 1363; Pricing 1: 1=2.43, 10=2.205, 100=1.89, 500=1.575, 1000=1.35, 5000=1.197, 10000=1.17 (USD); Mount: Through Hole; Color: Black; Contact Material: Bronze; Contact Plating: Gold; Material: Brass; Housing Material: Thermoplastic; Min Operating Temperature: -40°C; Max Operating Temperature: 105°C; Package Quantity: 1; Number of Rows: 1; Packaging: Rail/Tube; Termination: Solder; Number of Contacts: 8; Orientation: Right Angle; Voltage Rating (DC): 250V; Number of Circuits: 8; Pitch: 2.54mm; Contact Mating Length: 0.24inch; ELV: Compliant; Flammability Rating: UL94 V-0; ComponentLink1URL: https://www.molex.com/pdm_docs/ps/PS-70400.pdf?src-supplier=Digi-Key; ComponentLink1Description: https://www.molex.com/pdm_docs/ps/PS-70400.pdf?src-supplier=Digi-Key; ComponentLink2URL: http://www.mouser.com/ds/2/276/0705530112_PCB_HEADERS-172840.pdf?src-supplier=Mouser; ComponentLink2Description: http://www.mouser.com/ds/2/276/0705530112_PCB_HEADERS-172840.pdf?src-supplier=Mouser; Supplier Part Number 1: 23-0705530112-ND
R11-R13 = 0805-2.2KR: as R1 on sheet IsoPowerSupply; Supplier 1: Digi-Key; Stock 1: 4156138; Pricing 1: 1=0.1, 10=0.04, 100=0.0163, 1000=0.00731, 2500=0.00635 (USD); Case/Package: 0805; Number of Pins: 2; Case Code (Imperial): 0805; Case Code (Metric): 2012; Min Operating Temperature: -55°C; Max Operating Temperature: 155°C; Tolerance: 1%; Packaging: Tape and Reel; Voltage Rating (DC): 150V; Package Quantity: 1; Termination: SMD/SMT; Composition: Thick Film; Number of Terminations: 2; Max Power Dissipation: 125mW; Features: Moisture Resistant; Military Standard: Not; Length: 2mm; Height: 0.5mm; Width: 1.25mm; Depth: 1.25mm; Lead Pitch: 0.4mm; REACH SVHC: Unknown; Lead Free: Lead Free; ComponentLink1URL: http://www.farnell.com/datasheets/38627.pdf?src-supplier=Element14; ComponentLink1Description: http://www.farnell.com/datasheets/38627.pdf?src-supplier=Element14; ComponentLink2URL: http://www.farnell.com/datasheets/444164.pdf?src-supplier=Element14; ComponentLink2Description: http://www.farnell.com/datasheets/444164.pdf?src-supplier=Element14; ComponentLink3URL: http://www.yageo.com/documents/recent/PYu-RC_Group_51_RoHS_L_9.pdf?src-supplier=Digi-Key; ComponentLink3Description: http://www.yageo.com/documents/recent/PYu-RC_Group_51_RoHS_L_9.pdf?src-supplier=Digi-Key; ComponentLink4URL: http://www.yageo.com/documents/recent/PYu-RC_Group_51_RoHS_L_10.pdf?src-supplier=Digi-Key; ComponentLink4Description: http://www.yageo.com/documents/recent/PYu-RC_Group_51_RoHS_L_10.pdf?src-supplier=Digi-Key; Supplier Part Number 1: 311-2.20KCRDKR-ND
U9 = IMD-ir155-3402: ISOMETER iso-F1 IR155-3204